# EasyEDA schematic Schematic ESPHome P1 Gateway (working design).json
TITLE: ESPHome P1 Gateway; REV: 1.0; Date: 2021-06-21; Sheet: 1/1; Drawn By: Bart Olaerts; Company: BOlaerts
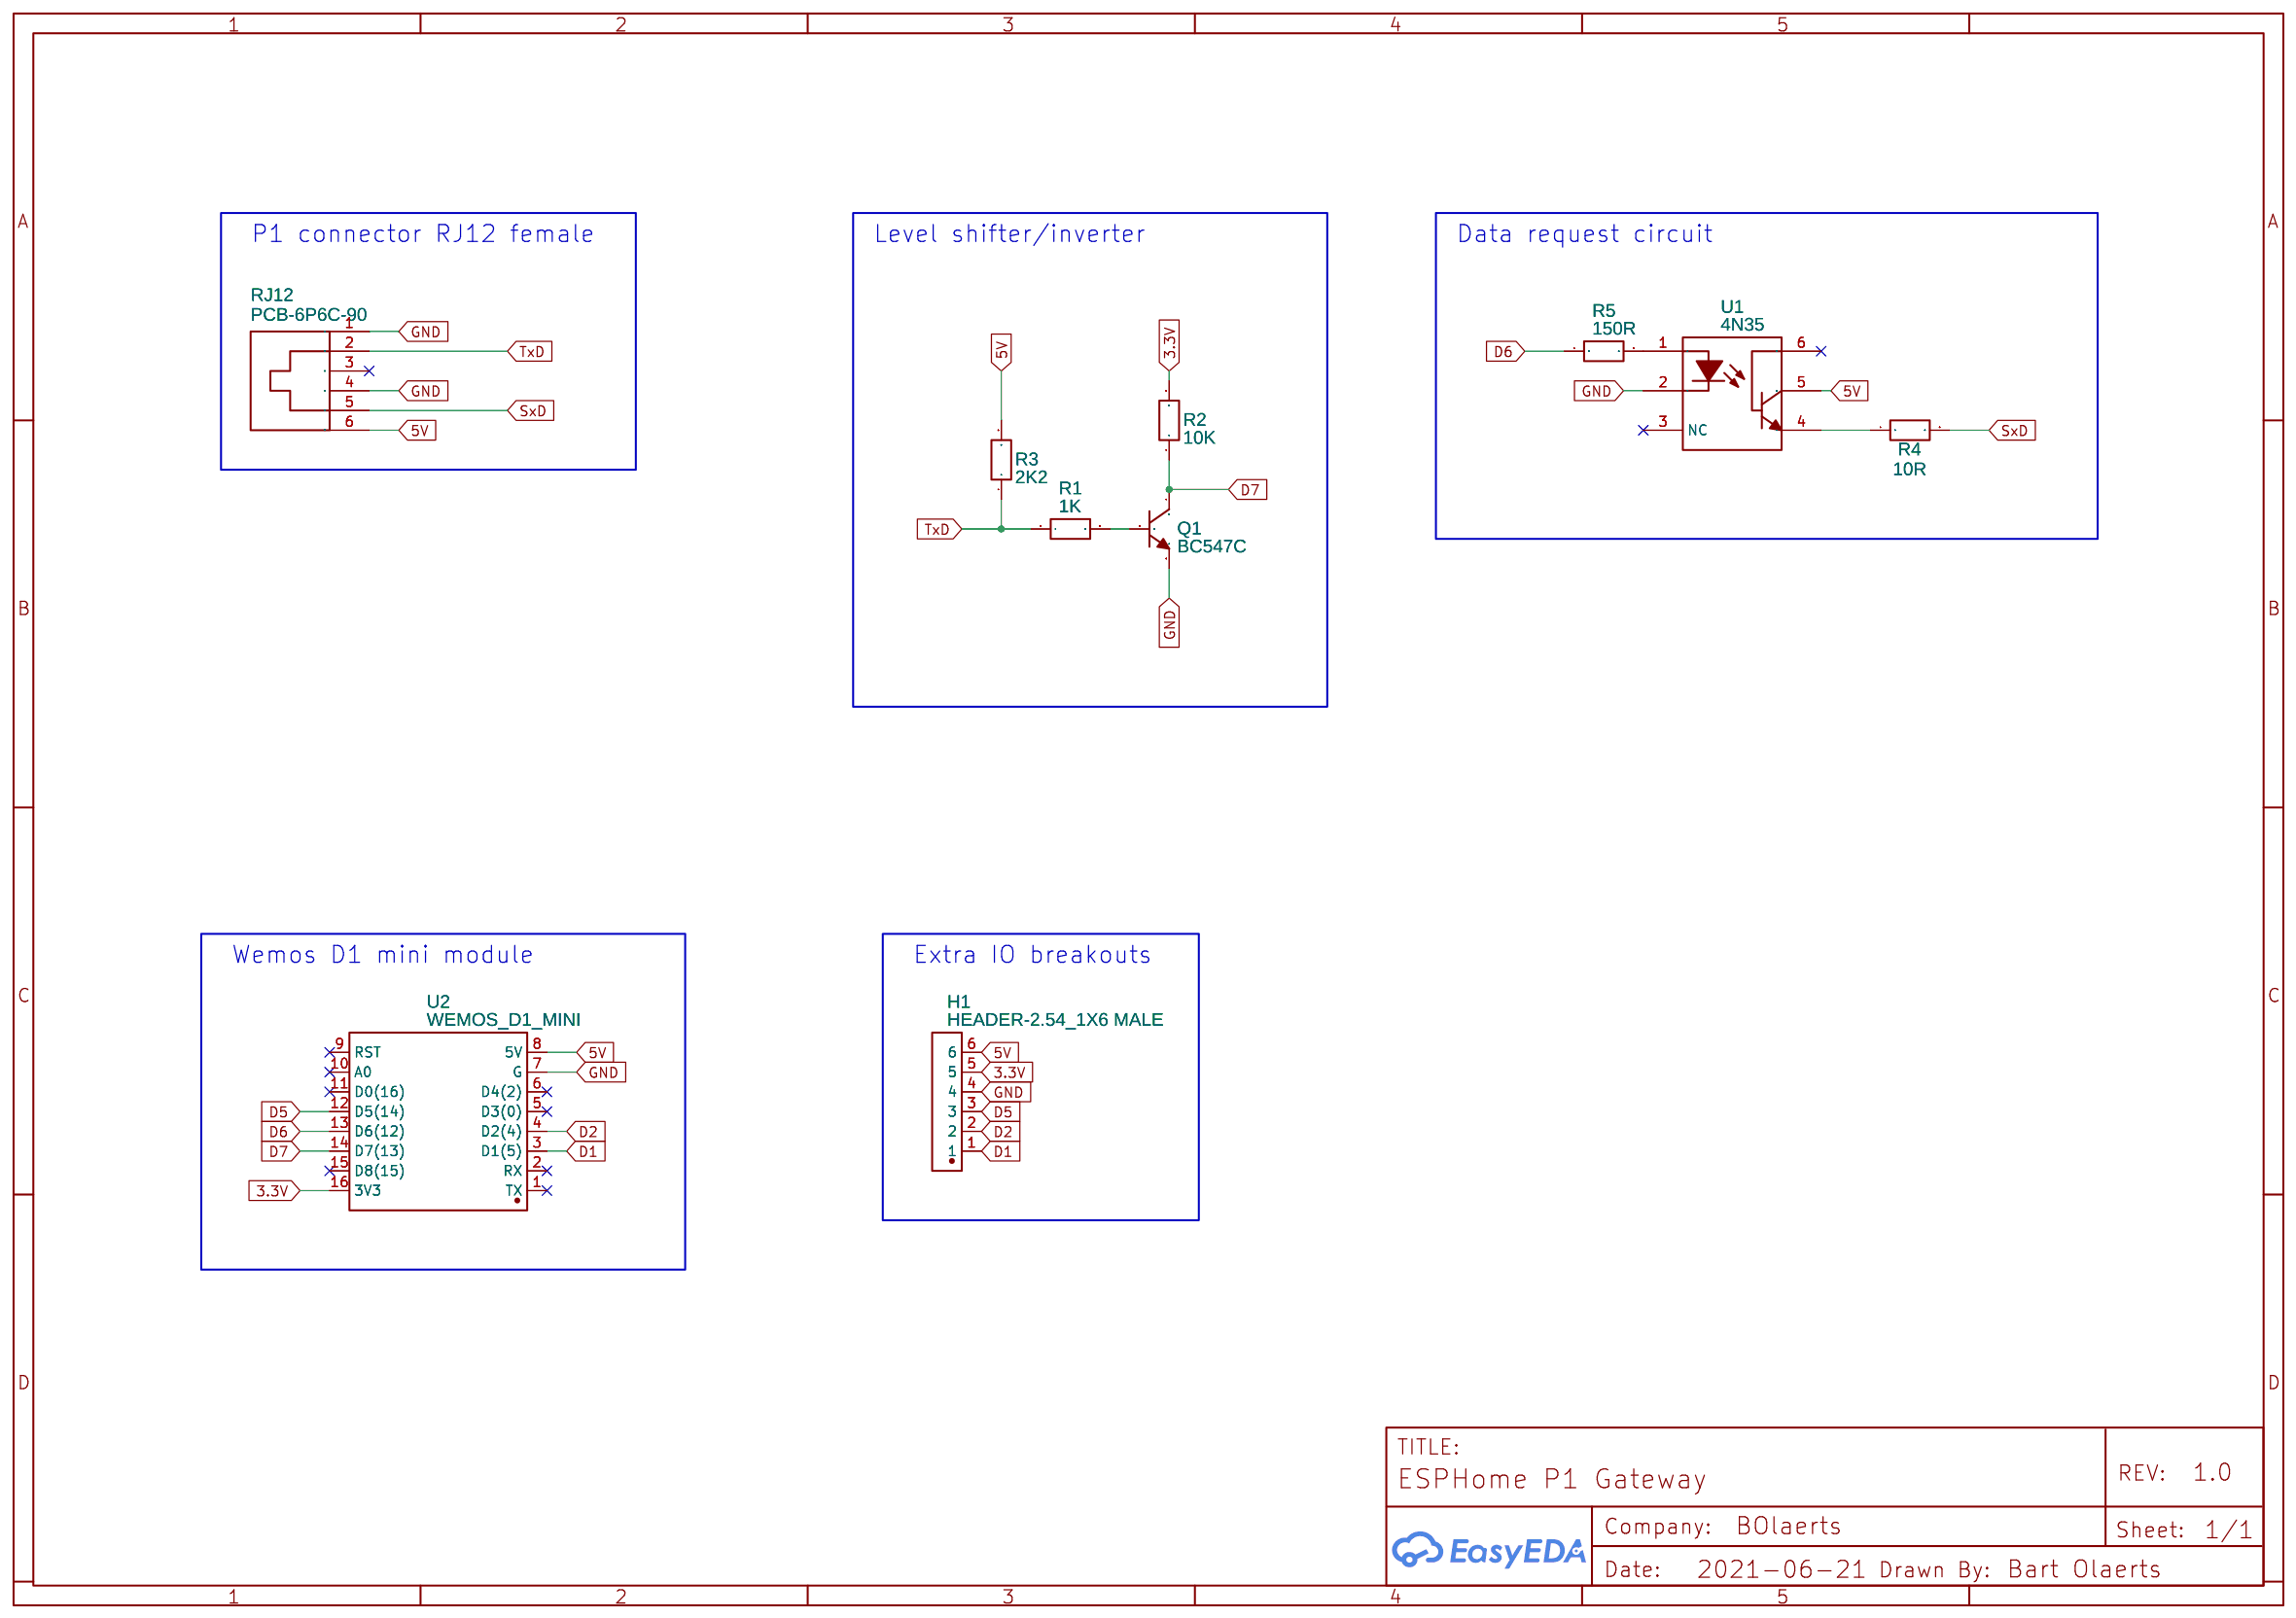
[diagram p0: schematic sheet]

## Parts
H1  HEADER-2.54_1X6 MALE  [HEADER-2.54_1X6 MALE]
Q1  BC547C  [TO-92-3_L4.9-W3.7-P1.27-L]
R1  1K  [RES-TH_BD2.4-L6.3-P10.30-D0.6]
R2  10K  [RES-TH_BD2.4-L6.3-P10.30-D0.6]
R3  2K2  [RES-TH_BD2.4-L6.3-P10.30-D0.6]
R4  10R  [RES-TH_BD2.4-L6.3-P10.30-D0.6]
R5  150R  [RES-TH_BD2.4-L6.3-P10.30-D0.6]
RJ12  PCB-6P6C-90  [RJ11-TH_PCB-6P6C-90]
U1  4N35  [DIP-6_L8.5-W6.4-P2.54-LS7.6-BL]
U2  WEMOS_D1_MINI  [DIP-16_WEMOS_D1_MINI_PRO4]

## Library data of the parts
H1 = HEADER-2.54_1X6 MALE: Supplier: LCSC; Manufacturer: ZHENGLING; Manufacturer Part: Z-211-0411-0021-001; Contributor: Tazul Islam; Supplier Part: C152150
Q1 = BC547C: Supplier: LCSC; Supplier Part: C713614; Manufacturer: LGE; Contributor: LCSC; JLCPCB Part Class: Extended Part
R1 = RD 1/2WS 10K J T/B A1: Supplier: LCSC; Supplier Part: C433797; Manufacturer: TyoHM; Contributor: LCSC; JLCPCB Part Class: Extended Part
R2-R5 = RD 1/2WS 10K J T/B A1: Supplier: LCSC; Supplier Part: C433797; Manufacturer: TyoHM; Contributor: LCSC; JLCPCB Part Class: Extended Part; Package Display: No
RJ12 = PCB-6P6C-90: Supplier: LCSC; Supplier Part: C189750; Manufacturer: Shenzhen Cankemeng; Contributor: LCSC; JLCPCB Part Class: Extended Part
U1 = 4N35: Supplier: LCSC; Manufacturer: EVERLIGHT; Supplier Part: C57084; JLCPCB Part Class: Extended Part
U2 = WEMOS_D1_MINI_PRO4: Supplier: LCSC; Supplier Part: C2837266; Manufacturer: null; Manufacturer Part: Wemos_D1_mini_Pro4; JLCPCB Part Class: Extended Part; Contributor: LCSC

## Nets
3.3V: H1.5 R2.2 U2.16(3V3)
5V: H1.6 R3.2 RJ12.6 U1.5 U2.8(5V)
GND: H1.4 Q1.3(E) RJ12.1 RJ12.4 U1.2 U2.7(G)
D1: H1.1 U2.3(D1(5))
D2: H1.2 U2.4(D2(4))
D5: H1.3 U2.12(D5(14))
D6: R5.1 U2.13(D6(12))
D7: Q1.1(C) R2.1 U2.14(D7(13))
SxD: R4.2 RJ12.5
TxD: R1.1 R3.1 RJ12.2
Net-(Q1-2): Q1.2(B) R1.2
Net-(R4-1): R4.1 U1.4
Net-(R5-2): R5.2 U1.1

Not connected (* = marked no-connect by the designer): RJ12 3*; U1 3(NC)* 6*; U2 1(TX)* 2(RX)* 5(D3(0))* 6(D4(2))* 9(RST)* 10(A0)* 11(D0(16))* 15(D8(15))*

## Notes on the sheet
- P1 connector RJ12 female
- Level shifter/inverter
- Data request circuit
- Wemos D1 mini module
- Extra IO breakouts
